# Altium schematic sheet K3000-0176_B.SchDoc: LED Status
size A3; Date: DO NOT USE, RATHER USE PROJ OPTIONS; DrawnBy: DO NOT USE, RATHER USE PROJ OPTIONS; Engineer: DO NOT USE, RATHER USE PROJ OPTIONS; Organization: DO NOT USE, RATHER USE PROJ OPTIONS; DocumentNumber: DO NOT USE, RATHER USE PROJ OPTIONS; Revision: DO NOT USE, RATHER USE PROJ OPTIONS; SheetNumber: 1; SheetTotal: 1; SCH_Sheet_Filename: K3000-0176_B.SchDoc; CurrentTime: DO NOT USE, RATHER USE PROJ OPTIONS; Time: DO NOT USE, RATHER USE PROJ OPTIONS; DocumentFullPathAndName: DO NOT USE, RATHER USE PROJ OPTIONS; DocumentName: DO NOT USE, RATHER USE PROJ OPTIONS; ModifiedDate: DO NOT USE, RATHER USE PROJ OPTIONS; ImagePath: DO NOT USE, RATHER USE PROJ OPTIONS
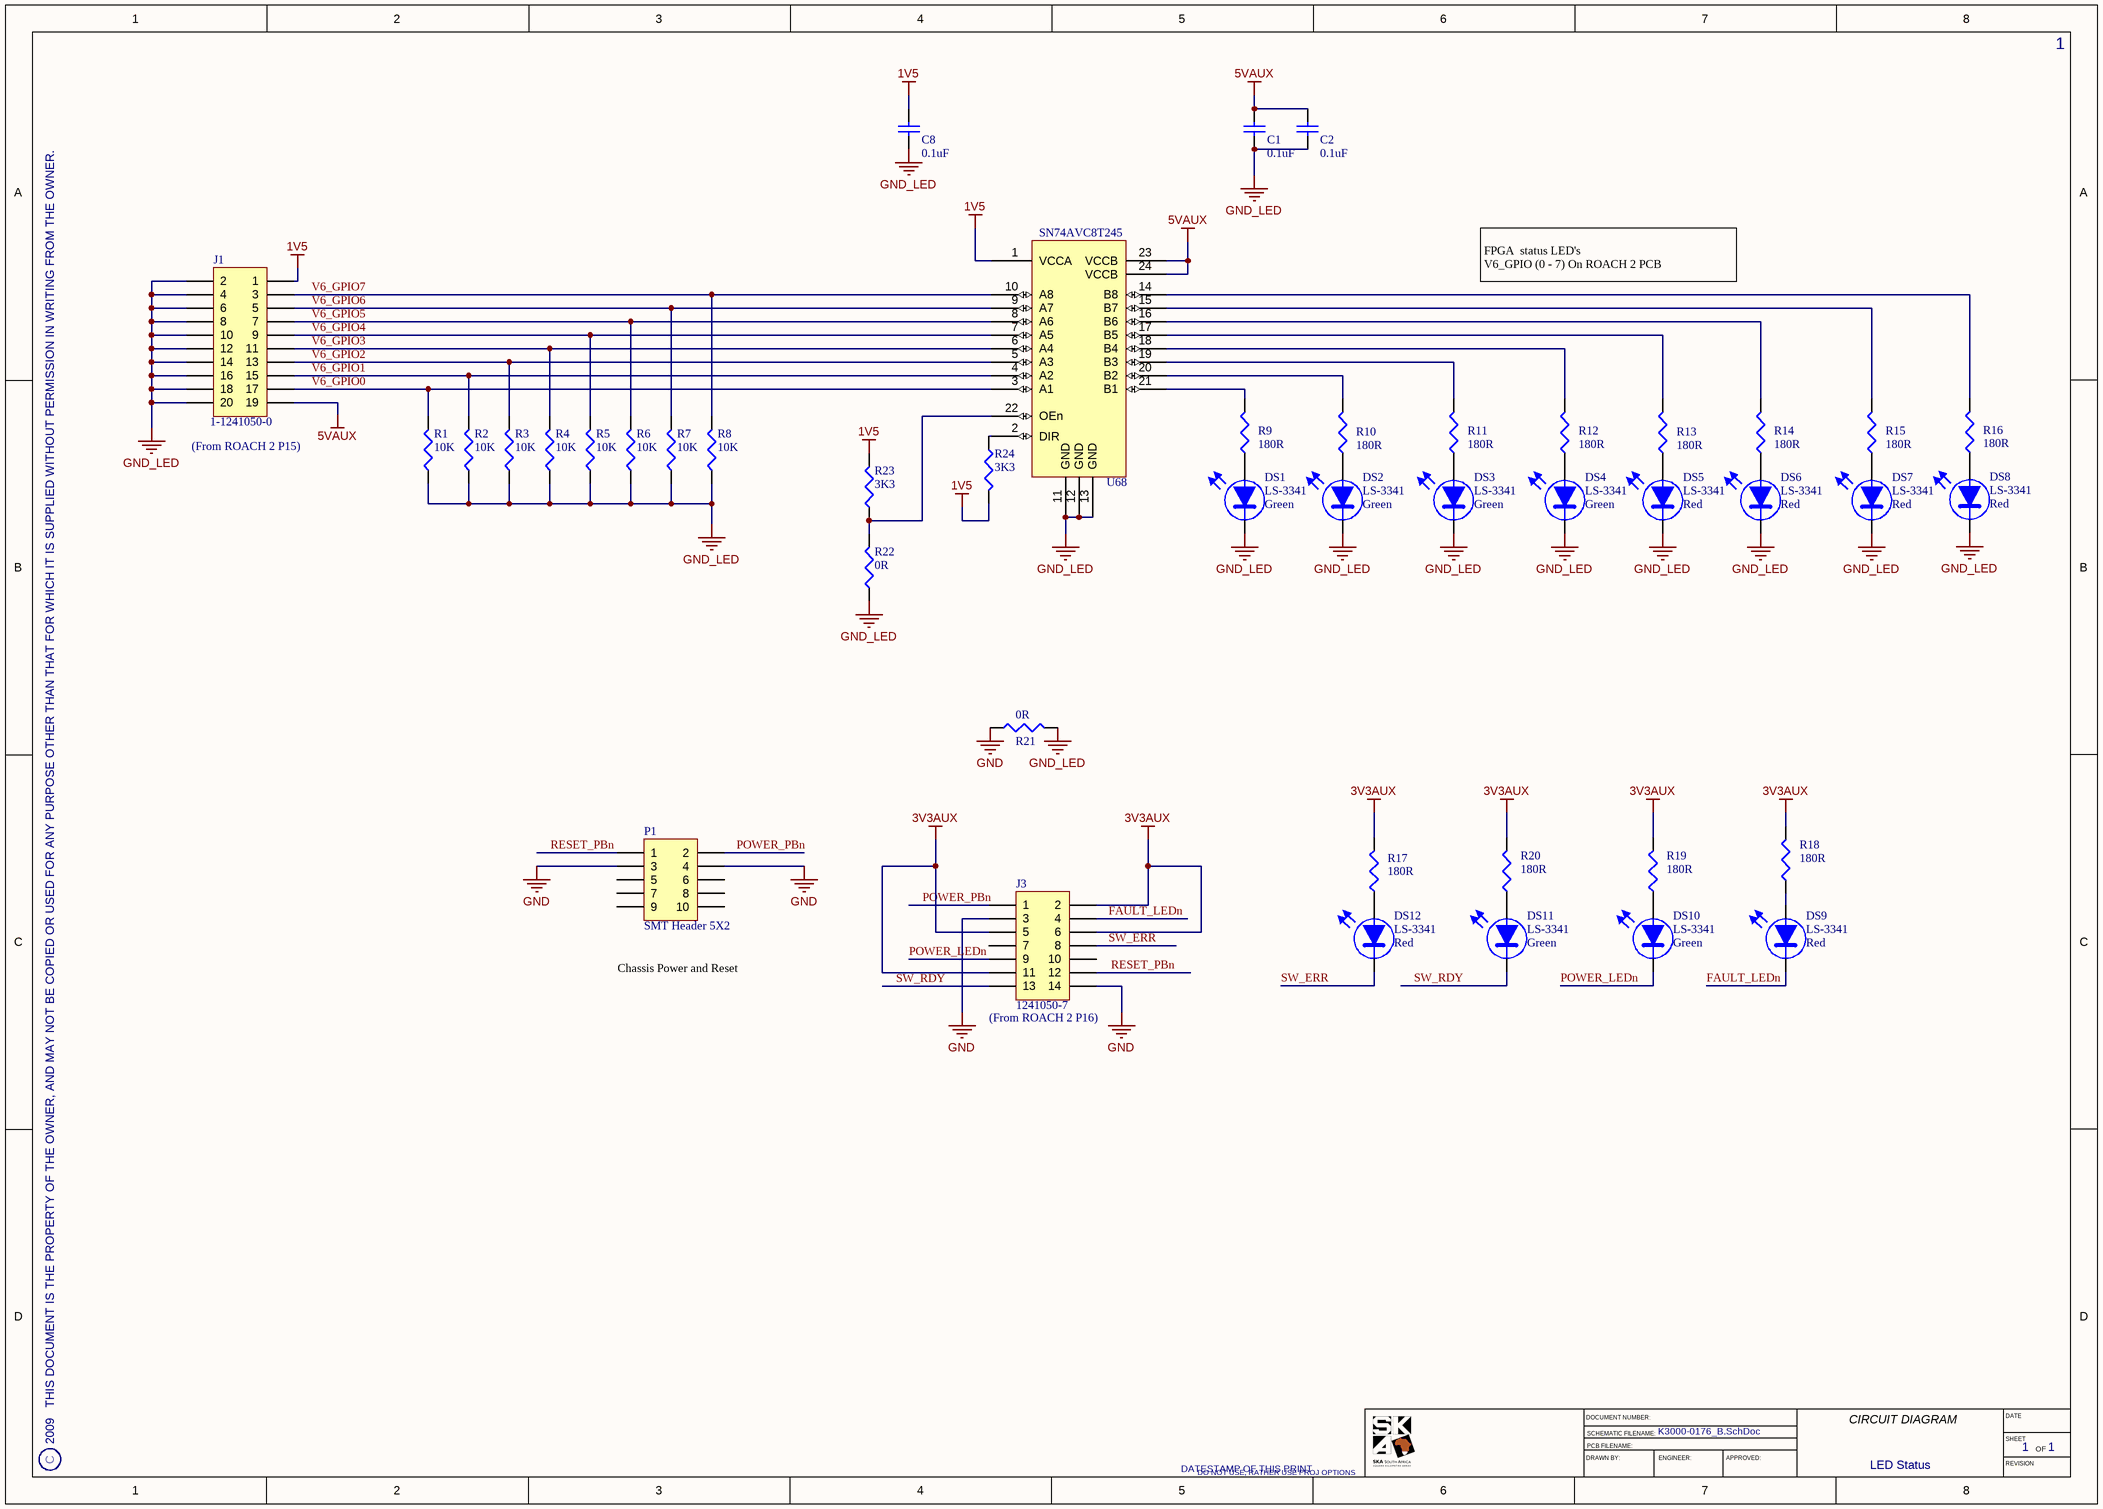
[diagram p0: K3000-0176_B.SchDoc]

## Parts
C1  0.1uF  [CAPC1005X60L]
C2  0.1uF  [CAPC1005X60L]
C8  0.1uF  [CAPC1005X60L]
DS1  LS-3341  Colour: Green  [LED-3MM]
DS2  LS-3341  Colour: Green  [LED-3MM]
DS3  LS-3341  Colour: Green  [LED-3MM]
DS4  LS-3341  Colour: Green  [LED-3MM]
DS5  LS-3341  Colour: Red  [LED-3MM]
DS6  LS-3341  Colour: Red  [LED-3MM]
DS7  LS-3341  Colour: Red  [LED-3MM]
DS8  LS-3341  Colour: Red  [LED-3MM]
DS9  LS-3341  Colour: Red  [LED-3MM]
DS10  LS-3341  Colour: Green  [LED-3MM]
DS11  LS-3341  Colour: Green  [LED-3MM]
DS12  LS-3341  Colour: Red  [LED-3MM]
J1  1-1241050-0  [HEADER 10x2, SMT]
J3  1241050-7  [HEADER 7x2, SMT]
P1  SMT Header 5X2  [HEADER 5x2, SMT]
R1  10K  [RESC1005X40L]
R2  10K  [RESC1005X40L]
R3  10K  [RESC1005X40L]
R4  10K  [RESC1005X40L]
R5  10K  [RESC1005X40L]
R6  10K  [RESC1005X40L]
R7  10K  [RESC1005X40L]
R8  10K  [RESC1005X40L]
R9  180R  [RESC1005X40L]
R10  180R  [RESC1005X40L]
R11  180R  [RESC1005X40L]
R12  180R  [RESC1005X40L]
R13  180R  [RESC1005X40L]
R14  180R  [RESC1005X40L]
R15  180R  [RESC1005X40L]
R16  180R  [RESC1005X40L]
R17  180R  [RESC1005X40L]
R18  180R  [RESC1005X40L]
R19  180R  [RESC1005X40L]
R20  180R  [RESC1005X40L]
R21  0R  [RESC1005X40L]
R22  0R  [RESC1005X40L]
R23  3K3  [RESC1005X40L]
R24  3K3  [RESC1005X40L]
U68  SN74AVC8T245  [PW024]

## Nets
1V5: C8.2 J1.1 R23.2 R24.2 U68.1(VCCA)
3V3AUX: J3.2 J3.5 J3.6 J3.11 R17.2 R18.2 R19.2 R20.2
5VAUX: C1.2 C2.2 J1.19 U68.23(VCCB) U68.24(VCCB)
GND: J3.3 J3.14 P1.3 P1.4 R21.1
GND_LED: C1.1 C2.1 C8.1 DS1.1(K) DS2.1(K) DS3.1(K) DS4.1(K) DS5.1(K) DS6.1(K) DS7.1(K) DS8.1(K) J1.2 J1.4 J1.6 J1.8 J1.10 J1.12 J1.14 J1.16 J1.18 J1.20 R1.1 R2.1 R3.1 R4.1 R5.1 R6.1 R7.1 R8.1 R21.2 R22.1 U68.11(GND) U68.12(GND) U68.13(GND)
FAULT_LEDn: DS9.1(K) J3.4
POWER_LEDn: DS10.1(K) J3.9
POWER_PBn: J3.1 P1.2
RESET_PBn: J3.12 P1.1
SW_ERR: DS12.1(K) J3.8
SW_RDY: DS11.1(K) J3.13
V6_GPIO0: J1.17 R1.2 U68.3(A1)
V6_GPIO1: J1.15 R2.2 U68.4(A2)
V6_GPIO2: J1.13 R3.2 U68.5(A3)
V6_GPIO3: J1.11 R4.2 U68.6(A4)
V6_GPIO4: J1.9 R5.2 U68.7(A5)
V6_GPIO5: J1.7 R6.2 U68.8(A6)
V6_GPIO6: J1.5 R7.2 U68.9(A7)
V6_GPIO7: J1.3 R8.2 U68.10(A8)
NetDS1_2: DS1.2(A) R9.1
NetDS2_2: DS2.2(A) R10.1
NetDS3_2: DS3.2(A) R11.1
NetDS4_2: DS4.2(A) R12.1
NetDS5_2: DS5.2(A) R13.1
NetDS6_2: DS6.2(A) R14.1
NetDS7_2: DS7.2(A) R15.1
NetDS8_2: DS8.2(A) R16.1
NetDS9_2: DS9.2(A) R18.1
NetDS10_2: DS10.2(A) R19.1
NetDS11_2: DS11.2(A) R20.1
NetDS12_2: DS12.2(A) R17.1
NetR9_2: R9.2 U68.21(B1)
NetR10_2: R10.2 U68.20(B2)
NetR11_2: R11.2 U68.19(B3)
NetR12_2: R12.2 U68.18(B4)
NetR13_2: R13.2 U68.17(B5)
NetR14_2: R14.2 U68.16(B6)
NetR15_2: R15.2 U68.15(B7)
NetR16_2: R16.2 U68.14(B8)
NetR22_2: R22.2 R23.1 U68.22(OEn)
NetR24_1: R24.1 U68.2(DIR)

Not connected (* = marked no-connect by the designer): J3 7 10; P1 5 6 7 8 9 10

## Notes on the sheet
- FPGA  status LED's
  V6_GPIO (0 - 7) On ROACH 2 PCB
- (near J1) (From ROACH 2 P15)
- (near P1) Chassis Power and Reset
- (near J3) (From ROACH 2 P16)
- 2009   THIS DOCUMENT IS THE PROPERTY OF THE OWNER, AND MAY NOT BE COPIED OR USED FOR ANY PURPOSE OTHER THAN THAT FOR WHICH IT IS SUPPLIED WITHOUT PERMISSION IN WRITING FROM THE OWNER.
- C
- DATESTAMP OF THIS PRINT
- DRAWN BY:
- DOCUMENT NUMBER:
- SCHEMATIC FILENAME:
- PCB FILENAME:
- ENGINEER:
- APPROVED:
- CIRCUIT DIAGRAM
- DATE
- SHEET
- REVISION
- OF

## Library data of the parts
C1 C2 C8 = CAP-CER-1: 0.1uF, Ceramic Capacitor; Manufacturer: VENKEL; PartNum: C0402X7R160-104KN; Tolerance: 10%; Rating: 16V; Dielectric: X7R; POD number: CAP-CER-1; RoHS: Y; Value: 0.1uF; Sort Value: 0.1; Category: Capacitors; Subcategory: Ceramic
DS1-DS4 DS10 DS11 = OPTO-LED-2: Green, 3mm, LED; Manufacturer: OSRAM; Vdrop: 2V; Rating: 10mA; POD number: OPTO-LED-2; PartNum: LS-3341; RoHS: Y; Category: OPTO; Subcategory: LED
DS5-DS9 DS12 = OPTO-LED-3: Red, 3mm, LED; Manufacturer: OSRAM; Vdrop: 2V; Rating: 10mA; POD number: OPTO-LED-3; PartNum: LS-3341; RoHS: Y; Category: OPTO; Subcategory: LED
J1 = CONN-PCB-22: 2x10, 2.54 mm Pitch, Male Header, Surface Mount; Manufacturer: AMP; LatestRevisionDate: 17-Jul-2002; LatestRevisionNote: Re-released for DXP Platform.; Publisher: Altium Limited; POD number: CONN-PCB-22; PartNum: 1-1241050-0; Category: CONN; Subcategory: PCB
J3 = CONN-PCB-21: 2x7, 2.54 mm Pitch, Male Header, Surface Mount; Manufacturer: AMP; LatestRevisionDate: 17-Jul-2002; LatestRevisionNote: Re-released for DXP Platform.; Publisher: Altium Limited; POD number: CONN-PCB-21; PartNum: 1241050-7; Category: CONN; Subcategory: PCB
P1 = CONN-PCB-20: 2x5, 2.54 mm Pitch, Male Header, Surface Mount; Manufacturer: AMP; PartNum: 1241050-5; LatestRevisionDate: 17-Jul-2002; LatestRevisionNote: Re-released for DXP Platform.; Publisher: Altium Limited; POD number: CONN-PCB-20; RoHS: Y; Category: CONN; Subcategory: PCB
R1-R8 = RES-TF-5: 10K, 1.1mm x 0.5mm, Thick Film Resistor; Manufacturer: ROYALOHM; PartNum: 0402WGJ0103T1E; Tolerance: 5%; Rating: 0.0625W; POD number: RES-TF-5; Value: 10K; Sort Value: 10000; Category: Resistors; Subcategory: ThickFilm; HelpURL: http://www.royalohm.com/pdf/general.pdf
R9-R20 = RES-TF-9: 180R, 1.1mm x 0.5mm, Thick Film Resistor; Manufacturer: ROYALOHM; PartNum: 0402WGJ0181T1E; Tolerance: 5%; Rating: 0.0625W; POD number: RES-TF-9; RoHS: Y; Value: 180R; Sort Value: 180; Category: Resistors; Subcategory: ThickFilm; HelpURL: http://www.royalohm.com/pdf/general.pdf
R21 R22 = RES-TF-0: 0R, 1.1mm x 0.5mm, Thick Film Resistor; Manufacturer: ROYALOHM; PartNum: 0402WG00000T1E; Tolerance: 0%; Rating: 0.0625W; POD number: RES-TF-0; Value: 0R; Sort Value: 0; Category: Resistors; Subcategory: ThickFilm
  R21: RoHS: Y; HelpURL: http://www.royalohm.com/pdf/general.pdf
  R22: HelpURL: *.pdf
R23 R24 = RES-TF-7: 3K3, 1.1mm x 0.5mm, Thick Film Resistor; Manufacturer: ROYALOHM; PartNum: 0402WGJ0332T1E; Tolerance: 5%; Rating: 0.0625W; POD number: RES-TF-7; Value: 3K3; Sort Value: 3300; Category: Resistors; Subcategory: ThickFilm; HelpURL: *.pdf
U68 = IC-LOG-10: 8-BIT DUAL-SUPPLY BUS TRANSCEIVER  WITH CONFIGURABLE VOLTAGE TRANSLATION AND 3-STATE OUTPUTS; Manufacturer: Texas Instruments; POD number: IC-LOG-10; PartNum: SN74AVC8T245; RoHS: Y; Category: IC; Subcategory: Logic